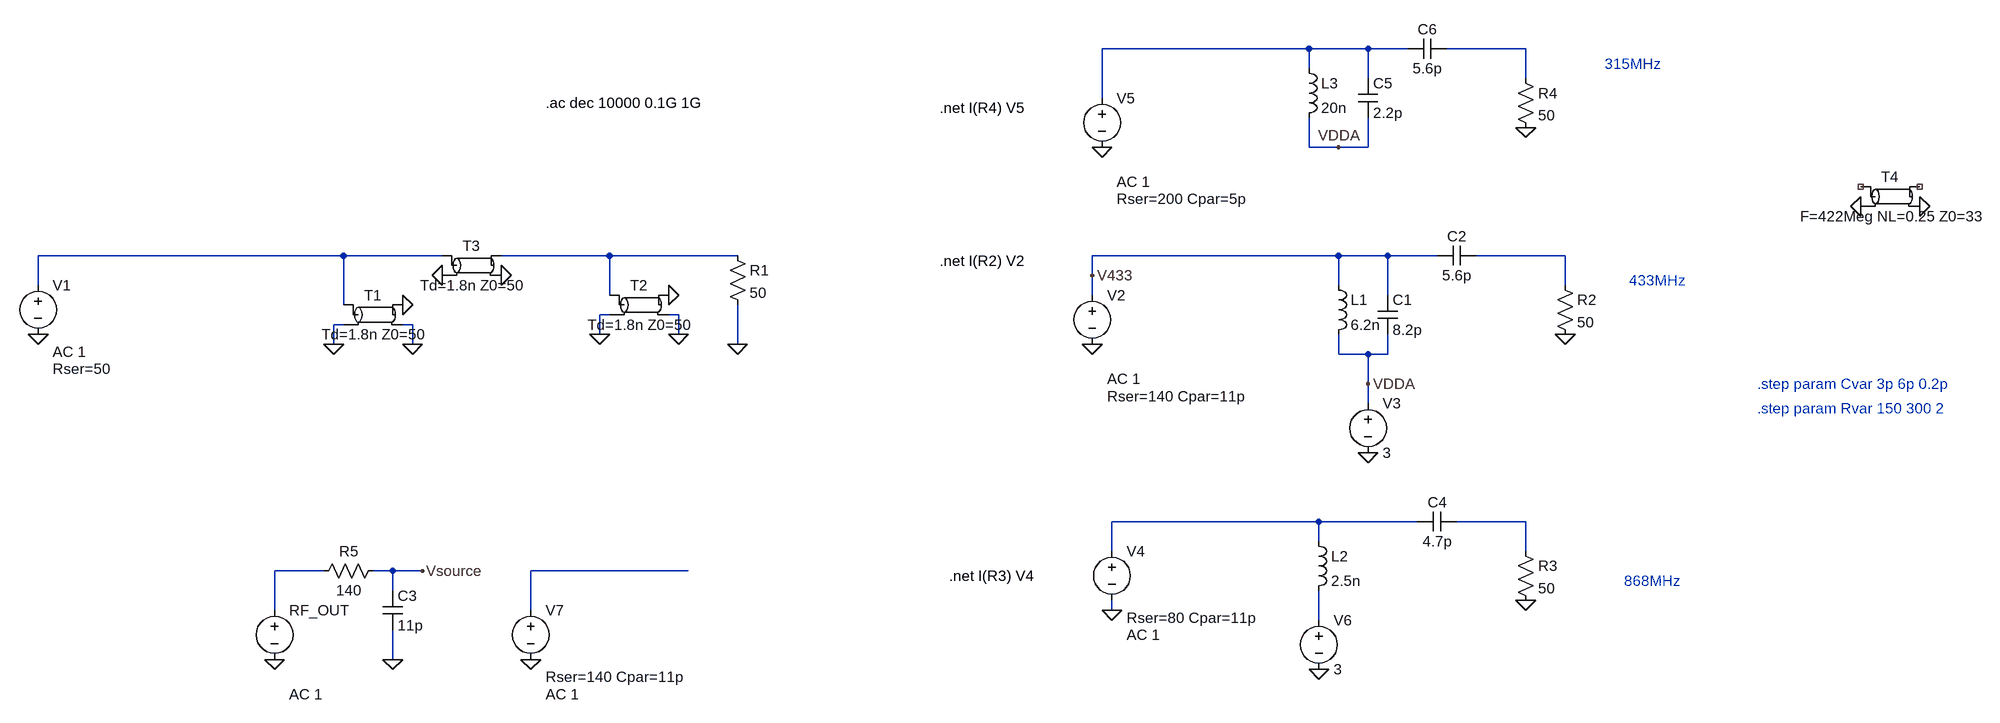
[diagram p0: schematic Matchings.asc]
Matchings.asc, the LTspice schematic file:
Version 4.1
SHEET 1 3360 808
WIRE 2128 -256 1792 -256
WIRE 2224 -256 2128 -256
WIRE 2288 -256 2224 -256
WIRE 2480 -256 2352 -256
WIRE 2128 -224 2128 -256
WIRE 2224 -208 2224 -256
WIRE 2480 -208 2480 -256
WIRE 1792 -176 1792 -256
WIRE 2128 -96 2128 -144
WIRE 2176 -96 2128 -96
WIRE 2224 -96 2224 -144
WIRE 2224 -96 2176 -96
WIRE 560 80 64 80
WIRE 720 80 560 80
WIRE 992 80 816 80
WIRE 1200 80 992 80
WIRE 2176 80 1776 80
WIRE 2256 80 2176 80
WIRE 2336 80 2256 80
WIRE 2544 80 2400 80
WIRE 1776 112 1776 80
WIRE 64 128 64 80
WIRE 2176 128 2176 80
WIRE 2544 128 2544 80
WIRE 992 144 992 80
WIRE 1776 144 1776 112
WIRE 2256 144 2256 80
WIRE 560 160 560 80
WIRE 992 176 976 176
WIRE 1104 176 1088 176
WIRE 560 192 544 192
WIRE 672 192 656 192
WIRE 976 208 976 176
WIRE 1104 208 1104 176
WIRE 544 224 544 192
WIRE 672 224 672 192
WIRE 1200 224 1200 160
WIRE 2176 240 2176 208
WIRE 2224 240 2176 240
WIRE 2256 240 2256 208
WIRE 2256 240 2224 240
WIRE 2224 288 2224 240
WIRE 2224 320 2224 288
WIRE 2144 512 1808 512
WIRE 2304 512 2144 512
WIRE 2480 512 2368 512
WIRE 2144 544 2144 512
WIRE 1808 560 1808 512
WIRE 2480 560 2480 512
WIRE 528 592 448 592
WIRE 640 592 608 592
WIRE 688 592 640 592
WIRE 1120 592 864 592
WIRE 640 624 640 592
WIRE 448 656 448 592
WIRE 864 656 864 592
WIRE 1808 656 1808 640
WIRE 2144 672 2144 624
WIRE 640 736 640 688
FLAG 544 224 0
FLAG 672 224 0
FLAG 1200 224 0
FLAG 64 208 0
FLAG 656 160 0
FLAG 720 112 0
FLAG 816 112 0
FLAG 976 208 0
FLAG 1104 208 0
FLAG 1088 144 0
FLAG 1776 224 0
FLAG 2224 400 0
FLAG 2544 208 0
FLAG 2480 640 0
FLAG 2480 -128 0
FLAG 2224 288 VDDA
FLAG 2176 -96 VDDA
FLAG 1808 656 0
FLAG 1792 -96 0
FLAG 2144 752 0
FLAG 3024 0 0
FLAG 3120 0 0
FLAG 864 736 0
FLAG 448 736 0
FLAG 640 736 0
FLAG 688 592 Vsource
FLAG 1776 112 V433
SYMBOL voltage 64 112 R0
WINDOW 123 24 124 Left 2
WINDOW 39 24 152 Left 2
SYMATTR Value2 AC 1
SYMATTR SpiceLine Rser=50
SYMATTR InstName V1
SYMATTR Value ""
SYMBOL tline 608 176 R0
SYMATTR InstName T1
SYMATTR Value Td=1.8n Z0=50
SYMBOL res 1184 64 R0
SYMATTR InstName R1
SYMATTR Value 50
SYMBOL tline 768 96 R0
SYMATTR InstName T3
SYMATTR Value Td=1.8n Z0=50
SYMBOL tline 1040 160 R0
SYMATTR InstName T2
SYMATTR Value Td=1.8n Z0=50
SYMBOL voltage 1776 128 R0
WINDOW 123 24 152 Left 2
WINDOW 39 24 180 Left 2
SYMATTR Value2 AC 1
SYMATTR SpiceLine Rser=140 Cpar=11p
SYMATTR InstName V2
SYMATTR Value ""
SYMBOL voltage 2224 304 R0
WINDOW 123 0 0 Left 0
WINDOW 39 0 0 Left 0
SYMATTR InstName V3
SYMATTR Value 3
SYMBOL ind 2160 112 R0
SYMATTR InstName L1
SYMATTR Value 6.2n
SYMBOL cap 2240 144 R0
SYMATTR InstName C1
SYMATTR Value 8.2p
SYMBOL cap 2400 64 R90
WINDOW 0 0 32 VBottom 2
WINDOW 3 32 32 VTop 2
SYMATTR InstName C2
SYMATTR Value 5.6p
SYMBOL res 2528 112 R0
SYMATTR InstName R2
SYMATTR Value 50
SYMBOL tline 3072 -16 R0
SYMATTR InstName T4
SYMATTR Value F=422Meg NL=0.25 Z0=33
SYMBOL ind 2128 528 R0
SYMATTR InstName L2
SYMATTR Value 2.5n
SYMBOL cap 2368 496 R90
WINDOW 0 0 32 VBottom 2
WINDOW 3 32 32 VTop 2
SYMATTR InstName C4
SYMATTR Value 4.7p
SYMBOL ind 2112 -240 R0
SYMATTR InstName L3
SYMATTR Value 20n
SYMBOL cap 2208 -208 R0
SYMATTR InstName C5
SYMATTR Value 2.2p
SYMBOL cap 2352 -272 R90
WINDOW 0 0 32 VBottom 2
WINDOW 3 32 32 VTop 2
SYMATTR InstName C6
SYMATTR Value 5.6p
SYMBOL res 2464 544 R0
SYMATTR InstName R3
SYMATTR Value 50
SYMBOL res 2464 -224 R0
SYMATTR InstName R4
SYMATTR Value 50
SYMBOL voltage 1808 544 R0
WINDOW 123 24 152 Left 2
WINDOW 39 24 124 Left 2
SYMATTR Value2 AC 1
SYMATTR SpiceLine Rser=80 Cpar=11p
SYMATTR InstName V4
SYMATTR Value ""
SYMBOL voltage 1792 -192 R0
WINDOW 123 24 152 Left 2
WINDOW 39 24 180 Left 2
SYMATTR Value2 AC 1
SYMATTR SpiceLine Rser=200 Cpar=5p
SYMATTR InstName V5
SYMATTR Value ""
SYMBOL voltage 2144 656 R0
WINDOW 123 0 0 Left 0
WINDOW 39 0 0 Left 0
SYMATTR InstName V6
SYMATTR Value 3
SYMBOL voltage 864 640 R0
WINDOW 123 24 152 Left 2
WINDOW 39 24 124 Left 2
WINDOW 3 24 44 Left 2
SYMATTR Value2 AC 1
SYMATTR SpiceLine Rser=140 Cpar=11p
SYMATTR Value ""
SYMATTR InstName V7
SYMBOL voltage 448 640 R0
WINDOW 123 24 152 Left 2
WINDOW 39 24 124 Left 2
WINDOW 3 24 44 Left 2
SYMATTR Value2 AC 1
SYMATTR Value ""
SYMATTR InstName RF_OUT
SYMBOL res 624 576 R90
WINDOW 0 0 56 VBottom 2
WINDOW 3 32 56 VTop 2
SYMATTR InstName R5
SYMATTR Value 140
SYMBOL cap 624 624 R0
SYMATTR InstName C3
SYMATTR Value 11p
TEXT 1528 88 Left 2 !.net I(R2) V2
TEXT 888 -168 Left 2 !.ac dec 10000 0.1G 1G
TEXT 2648 120 Left 2 ;433MHz
TEXT 1544 600 Left 2 !.net I(R3) V4
TEXT 2640 608 Left 2 ;868MHz
TEXT 2856 288 Left 2 ;.step param Cvar 3p 6p 0.2p
TEXT 2856 328 Left 2 ;.step param Rvar 150 300 2
TEXT 1528 -160 Left 2 !.net I(R4) V5
TEXT 2608 -232 Left 2 ;315MHz

The netlist it stands for:
* Matchings.asc
V1 N003 0 AC 1 Rser=50
T1 N003 0 0 0 Td=1.8n Z0=50
R1 N004 0 50
T3 N003 0 N004 0 Td=1.8n Z0=50
T2 N004 0 0 0 Td=1.8n Z0=50
V2 V433 0 AC 1 Rser=140 Cpar=11p
V3 VDDA 0 3
L1 V433 VDDA 6.2n
C1 V433 VDDA 8.2p
C2 N005 V433 5.6p
R2 N005 0 50
T4 NC_01 0 NC_02 0 F=422Meg NL=0.25 Z0=33
L2 N006 N010 2.5n
C4 N007 N006 4.7p
L3 N001 VDDA 20n
C5 N001 VDDA 2.2p
C6 N002 N001 5.6p
R3 N007 0 50
R4 N002 0 50
V4 N006 0 AC 1 Rser=80 Cpar=11p
V5 N001 0 AC 1 Rser=200 Cpar=5p
V6 N010 0 3
V7 N009 0 AC 1 Rser=140 Cpar=11p
V§RF_OUT N008 0 AC 1
R5 Vsource N008 140
C3 Vsource 0 11p
.net I(R2) V2
.ac dec 10000 0.1G 1G
* 433MHz
.net I(R3) V4
* 868MHz
* .step param Cvar 3p 6p 0.2p
* .step param Rvar 150 300 2
.net I(R4) V5
* 315MHz
.backanno
.end